# Altium project AT90PWM_Differential_PCB.PrjPcb
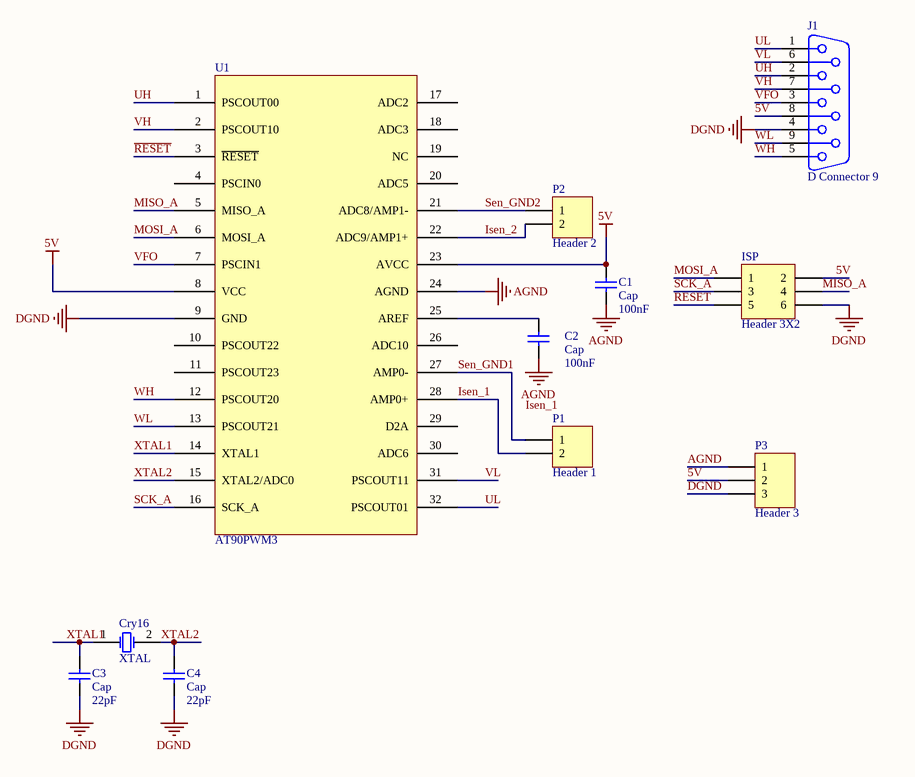
[diagram p0: AT90PWM_PCB_Diff.SchDoc]
1 sheet, 11 parts. Net scope: global (net labels, ports and power ports of the same name join across sheets).
Board file: AT90PWM_PCB_Diff_v2.PcbDoc

## Sheet AT90PWM_PCB_Diff.SchDoc
size A4

### Parts
C1  Cap  value 100nF  [NPolar_Cap]
C2  Cap  value 100nF  [NPolar_Cap]
C3  Cap  value 22pF  [NPolar_Cap]
C4  Cap  value 22pF  [NPolar_Cap]
Cry16  XTAL  [16MHz Crystal]
ISP  Header 3X2  [HDR2X3]
J1  D Connector 9  [DSUB1.385-2H9]
P1  Header 1  [HDR1X2]
P2  Header 2  [HDR1X2]
P3  Header 3  [HDR1X3]
U1  AT90PWM3  [AT90PWM3B]

### Nets
5V: C1.2 ISP.2 J1.8 P3.2 U1.8(VCC) U1.23(AVCC)
AGND: C1.1 C2.1 P3.1 U1.24(AGND)
DGND: C3.1 C4.1 ISP.6 J1.4 P3.3 U1.9(GND)
~{RESET}: ISP.5 U1.3(~{RESET})
Isen_1: P1.2 U1.28(AMP0+)
Isen_2: P2.2 U1.22(ADC9/AMP1+)
MISO_A: ISP.4 U1.5(MISO_A)
MOSI_A: ISP.1 U1.6(MOSI_A)
SCK_A: ISP.3 U1.16(SCK_A)
Sen_GND1: P1.1 U1.27(AMP0-)
Sen_GND2: P2.1 U1.21(ADC8/AMP1-)
UH: J1.2 U1.1(PSCOUT00)
UL: J1.1 U1.32(PSCOUT01)
VFO: J1.3 U1.7(PSCIN1)
VH: J1.7 U1.2(PSCOUT10)
VL: J1.6 U1.31(PSCOUT11)
WH: J1.5 U1.12(PSCOUT20)
WL: J1.9 U1.13(PSCOUT21)
XTAL1: C3.2 Cry16.1(OSC1) U1.14(XTAL1)
XTAL2: C4.2 Cry16.2(OSC2) U1.15(XTAL2/ADC0)
NetC2_2: C2.2 U1.25(AREF)

Not connected (* = marked no-connect by the designer): U1 4(PSCIN0) 10(PSCOUT22) 11(PSCOUT23) 17(ADC2) 18(ADC3) 19(NC) 20(ADC5) 26(ADC10) 29(D2A) 30(ADC6)

### Notes on the sheet
- Labels drawn without touching a wire or pin: Isen_1

### Library data of the parts
C1-C4 = Cap: Capacitor; Published: 8-Jun-2000; LatestRevisionDate: 17-Jul-2002; LatestRevisionNote: Re-released for DXP Platform.; PackageReference: RAD-0.3; Publisher: Altium Limited
Cry16 = XTAL: Crystal Oscillator; Published: 8-Jun-2000; LatestRevisionDate: 17-Jul-2002; LatestRevisionNote: Re-released for DXP Platform.; PackageReference: R38; Publisher: Altium Limited
ISP = Header 3X2: Header, 3-Pin, Dual row; LatestRevisionDate: 17-Jul-2002; LatestRevisionNote: Re-released for DXP Platform.; Publisher: Altium Limited
J1 = D Connector 9: Receptacle Assembly, 9 Position, Right Angle; PackageDocument: O; Positions: 9; Published: 15-Jun-2001; LatestRevisionDate: 17-Jul-2002; LatestRevisionNote: Re-released for DXP Platform.; DatasheetDocument: 1-Sep-1999; PackageReference: 788750; Publisher: Altium Limited; Orientation: Right Angle; Gender: Receptacle
P1 P2 = Header 2: Header, 2-Pin; LatestRevisionDate: 17-Jul-2002; LatestRevisionNote: Re-released for DXP Platform.; Publisher: Altium Limited
P3 = Header 3: Header, 3-Pin; LatestRevisionDate: 17-Jul-2002; LatestRevisionNote: Re-released for DXP Platform.; Publisher: Altium Limited